# EAGLE design Fan speed controller v1 (EAGLE 5.12)
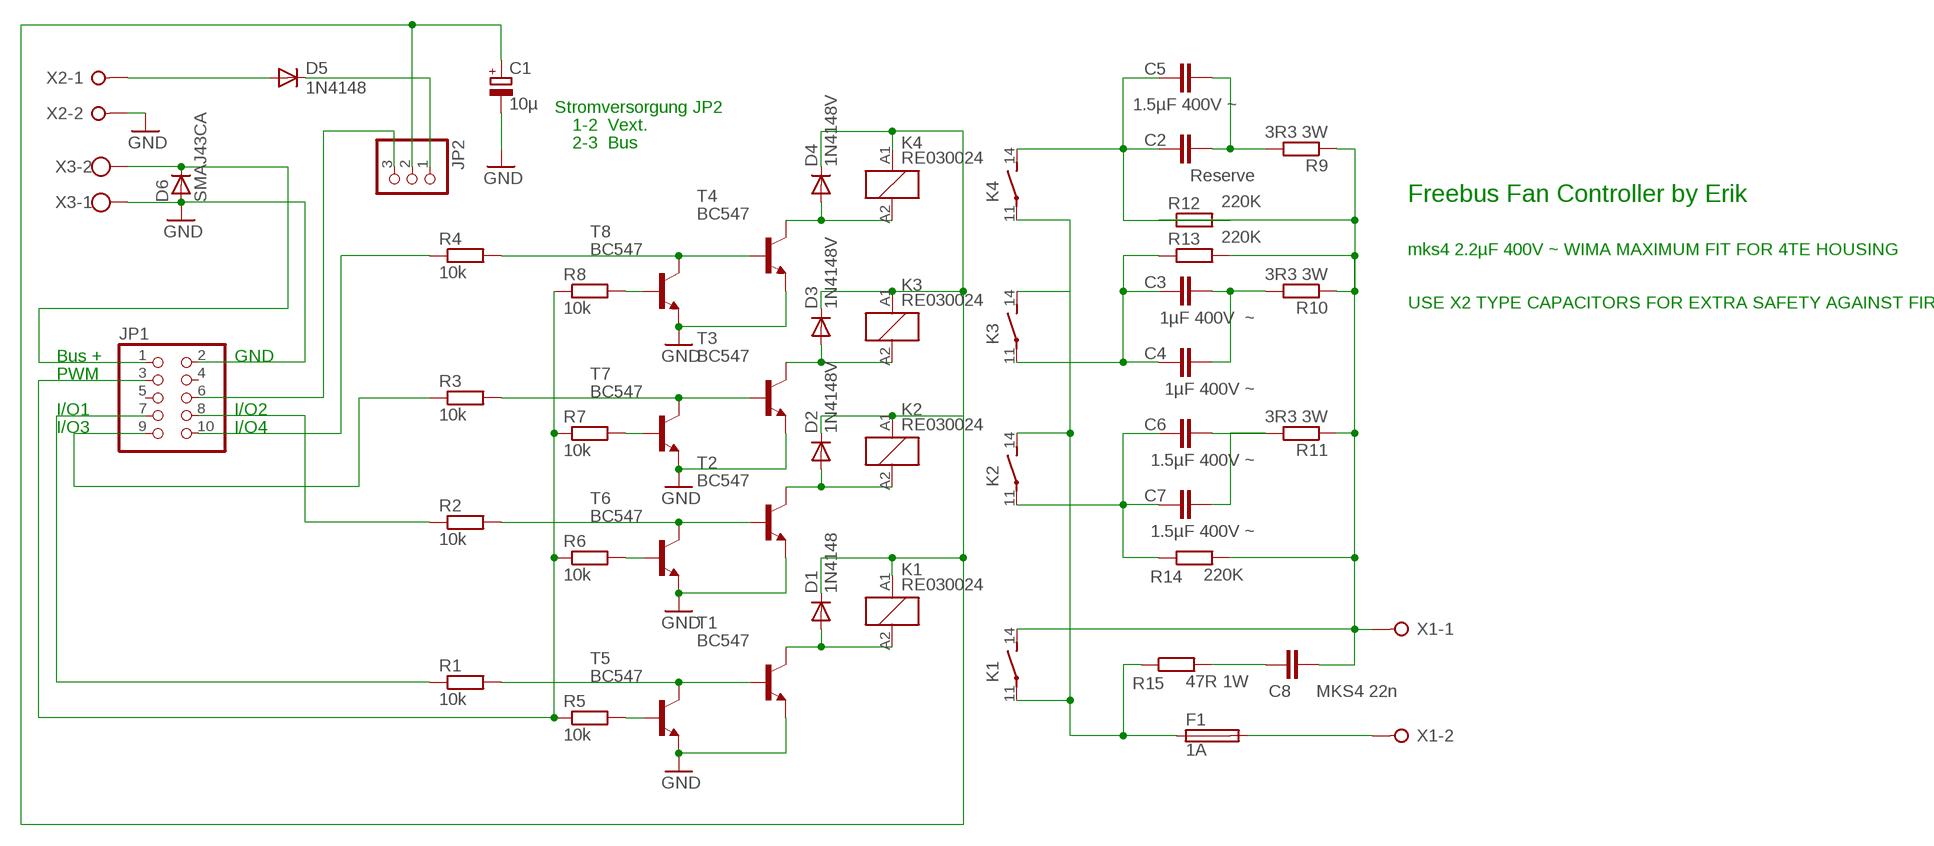
[diagram p0: schematic, sheet 1]

## Parts
C1  10µ  CPOL-EUE3.5-10  [E3,5-10]
C2  Reserve  C-EU275-113X316  [C275-113X316]
C3  1µF 400V ~  C-EU275-113X316  [C275-113X316]
C4  1µF 400V ~  C-EU275-113X316  [C275-113X316]
C5  1.5µF 400V ~  C-EU275-113X316  [C275-113X316]
C6  1.5µF 400V ~  C-EU275-113X316  [C275-113X316]
C7  1.5µF 400V ~  C-EU275-113X316  [C275-113X316]
C8  MKS4 22n  C7.5/6  [C7.5B6]
D1  1N4148  1N4148DO35-7  [DO35-7]
D2  1N4148V  1N4148DO35-7  [DO35-7]
D3  1N4148V  1N4148DO35-7  [DO35-7]
D4  1N4148V  1N4148DO35-7  [DO35-7]
D5  1N4148  1N4148DO35-7  [DO35-7]
D6  SMAJ43CA  D-SMB  [SMB]
F1  1A  SH22,5  [SH22,5]
JP1  PINHD-2X5  [2X05]
JP2  PINHD-1X3  [1X03]
K1  RE030024  [RE-SCHRACK]
K2  RE030024  [RE-SCHRACK]
K3  RE030024  [RE-SCHRACK]
K4  RE030024  [RE-SCHRACK]
R1  10k  R-EU_0207/7  [0207/7]
R2  10k  R-EU_0207/7  [0207/7]
R3  10k  R-EU_0207/7  [0207/7]
R4  10k  R-EU_0207/7  [0207/7]
R5  10k  R-EU_0207/7  [0207/7]
R6  10k  R-EU_0207/7  [0207/7]
R7  10k  R-EU_0207/7  [0207/7]
R8  10k  R-EU_0207/7  [0207/7]
R9  3R3 3W  R-EU_0613/15  [P0613/15]
R10  3R3 3W  R-EU_0613/15  [P0613/15]
R11  3R3 3W  R-EU_0613/15  [P0613/15]
R12  220K  R-EU_0207/5V  [0207/5V]
R13  220K  R-EU_0207/10  [0207/10]
R14  220K  R-EU_0207/10  [0207/10]
R15  47R 1W  R-EU_0207/5V  [0207/5V]
T1  BC547  [TO92]
T2  BC547  [TO92]
T3  BC547  [TO92]
T4  BC547  [TO92]
T5  BC547  [TO92]
T6  BC547  [TO92]
T7  BC547  [TO92]
T8  BC547  [TO92]
X1  W237-02P  [W237-132]
X2  W237-02P  [W237-132]
X3  W237-102  [W237-102]

## Nets
GND: C1.- D6.2(A) JP1.2 T1.1(E) T2.1(E) T3.1(E) T4.1(E) T5.1(E) T6.1(E) T7.1(E) T8.1(E) X2.2 X3.1
N$1: D5.A X2.1
N$2: C8.2 K1.14(2:S) R9.1 R10.1 R11.1 R12.1 R13.2 R14.2 X1.1
N$3: JP1.6 JP2.3
N$4: D6.1(C) JP1.1 X3.2
N$5: C2.1 C5.1 K4.14(2:S) R12.2
N$6: C3.1 C4.1 K3.11(2:P) R13.1
N$7: JP1.7 R1.1
N$8: C6.1 C7.1 K2.11(2:P) R14.1
N$9: JP1.8 R2.1
N$10: JP1.10 R4.1
N$11: R4.2 T4.2(B) T8.3(C)
N$12: JP1.3 R5.1 R6.1 R7.1 R8.1
N$13: F1.1 K1.11(2:P) K2.14(2:S) K3.14(2:S) K4.11(2:P) R15.1
N$14: R3.2 T3.2(B) T7.3(C)
N$15: C2.2 C5.2 R9.2
N$16: C3.2 C4.2 R10.2
N$17: R2.2 T2.2(B) T6.3(C)
N$18: R1.2 T1.2(B) T5.3(C)
N$19: D2.A K2.A2 T2.3(C)
N$20: R8.2 T8.2(B)
N$21: R7.2 T7.2(B)
N$22: R6.2 T6.2(B)
N$23: R5.2 T5.2(B)
N$24: D1.A K1.A2 T1.3(C)
N$25: C6.2 C7.2 R11.2
N$26: JP1.9 R3.1
N$27: C8.1 R15.2
N$28: F1.2 X1.2
N$31: D5.C JP2.1
R3: D3.A K3.A2 T3.3(C)
R4: D4.A K4.A2 T4.3(C)
VDD_IN: C1.+ D1.C D2.C D3.C D4.C JP2.2 K1.A1 K2.A1 K3.A1 K4.A1
Unconnected: JP1.4 JP1.5

## Notes on the sheet
- Stromversorgung JP2
- 1-2  Vext.
- 2-3  Bus
- Freebus Fan Controller by Erik
- mks4 2.2µF 400V ~ WIMA MAXIMUM FIT FOR 4TE HOUSING
- USE X2 TYPE CAPACITORS FOR EXTRA SAFETY AGAINST FIRE
- Bus + | GND
- PWM
- I/O1 | I/O2
- I/O3 | I/O4

## Library data of the parts
C1 = rcl:CPOL-EU: POLARIZED CAPACITOR, European symbol
C2-C7 = rcl:C-EU: CAPACITOR, European symbol
C8 = capacitor-wima:C: CAPACITOR naming: grid - package width
D1-D5 = diode:1N4148: DIODE high speed (Philips)
D6 = semicon-smd-ipc:D-: DIODE unfilled
F1 = fuse:SH22,5: FUSE HOLDER grid 22,5 mm, OGN0031 8201, Schurter (Buerklin); MF: SCHURTER; MPN: 0031.8201; OC_FARNELL: 1162740; OC_NEWARK: 96F8317
JP1 = pinhead:PINHD-2X5: PIN HEADER
JP2 = pinhead:PINHD-1X3: PIN HEADER
K1-K4 = relay:RE03*: Miniature PCB Relay 1 pole 6 A SCHRACK Source: http://www.schrack.com/.. 5812.pdf
R1-R15 = rcl:R-EU_: RESISTOR, European symbol
T1-T8 = transistor-npn:BC547*: NPN Transistor
X1 X2 = con-wago-508:W237-02P: WAGO SREW CLAMP; OC_FARNELL: unknown; OC_NEWARK: unknown
X3 = con-wago-500:W237-102: WAGO SCREW CLAMP; MPN: 237-102; OC_FARNELL: unknown; OC_NEWARK: 70K9898

## Board
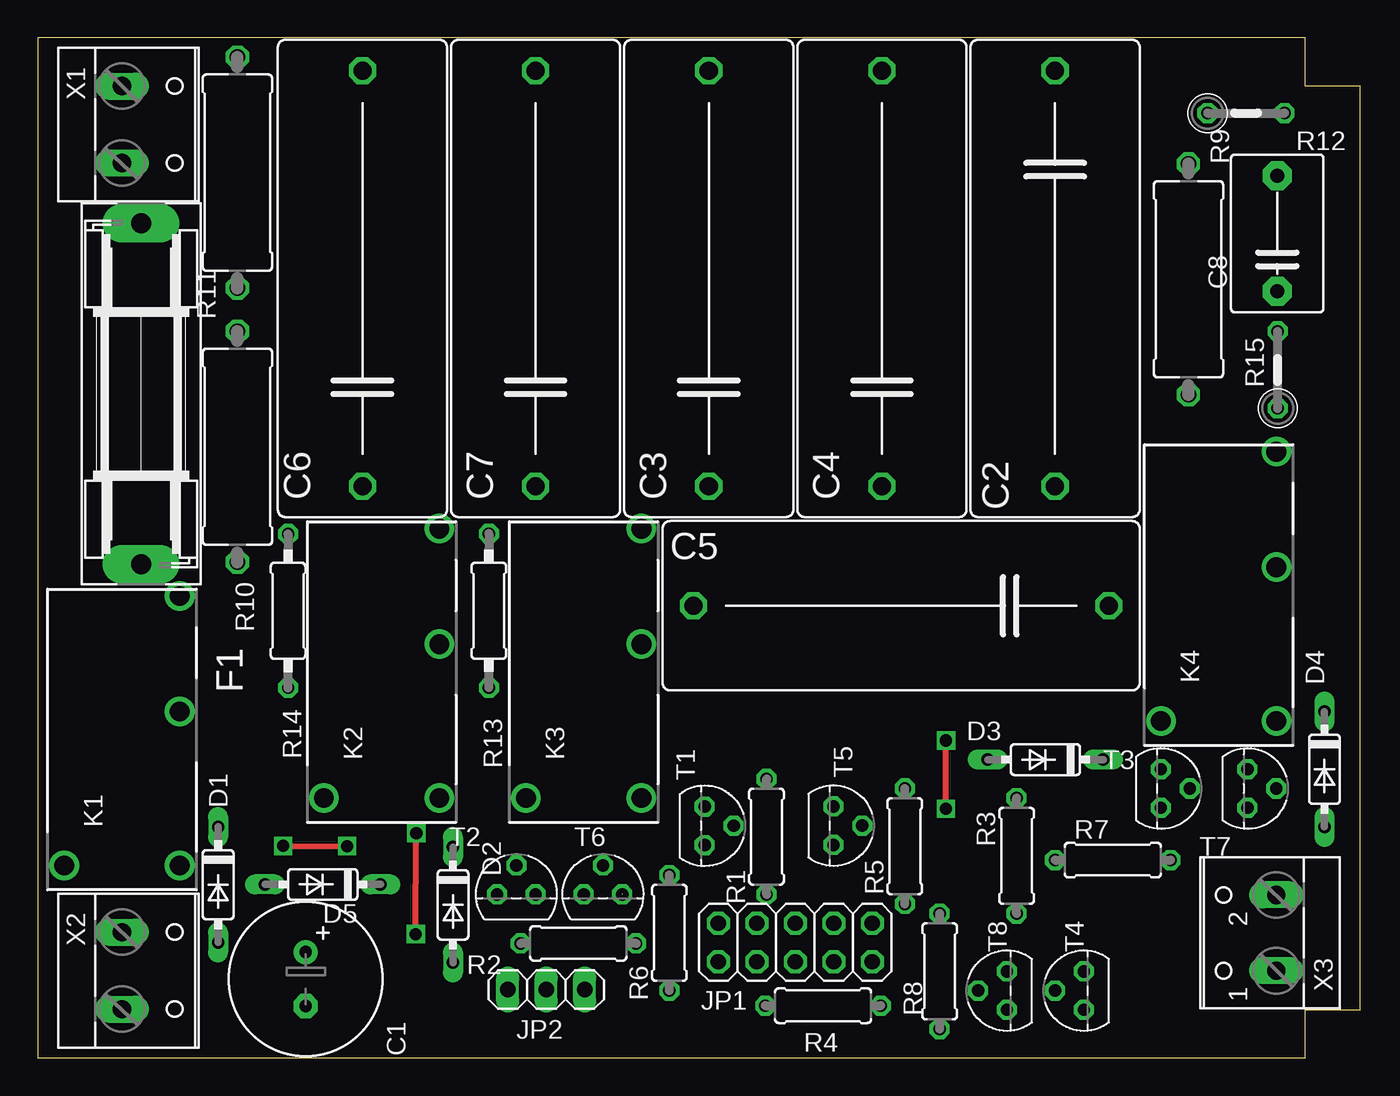
[diagram p1: board, top side]
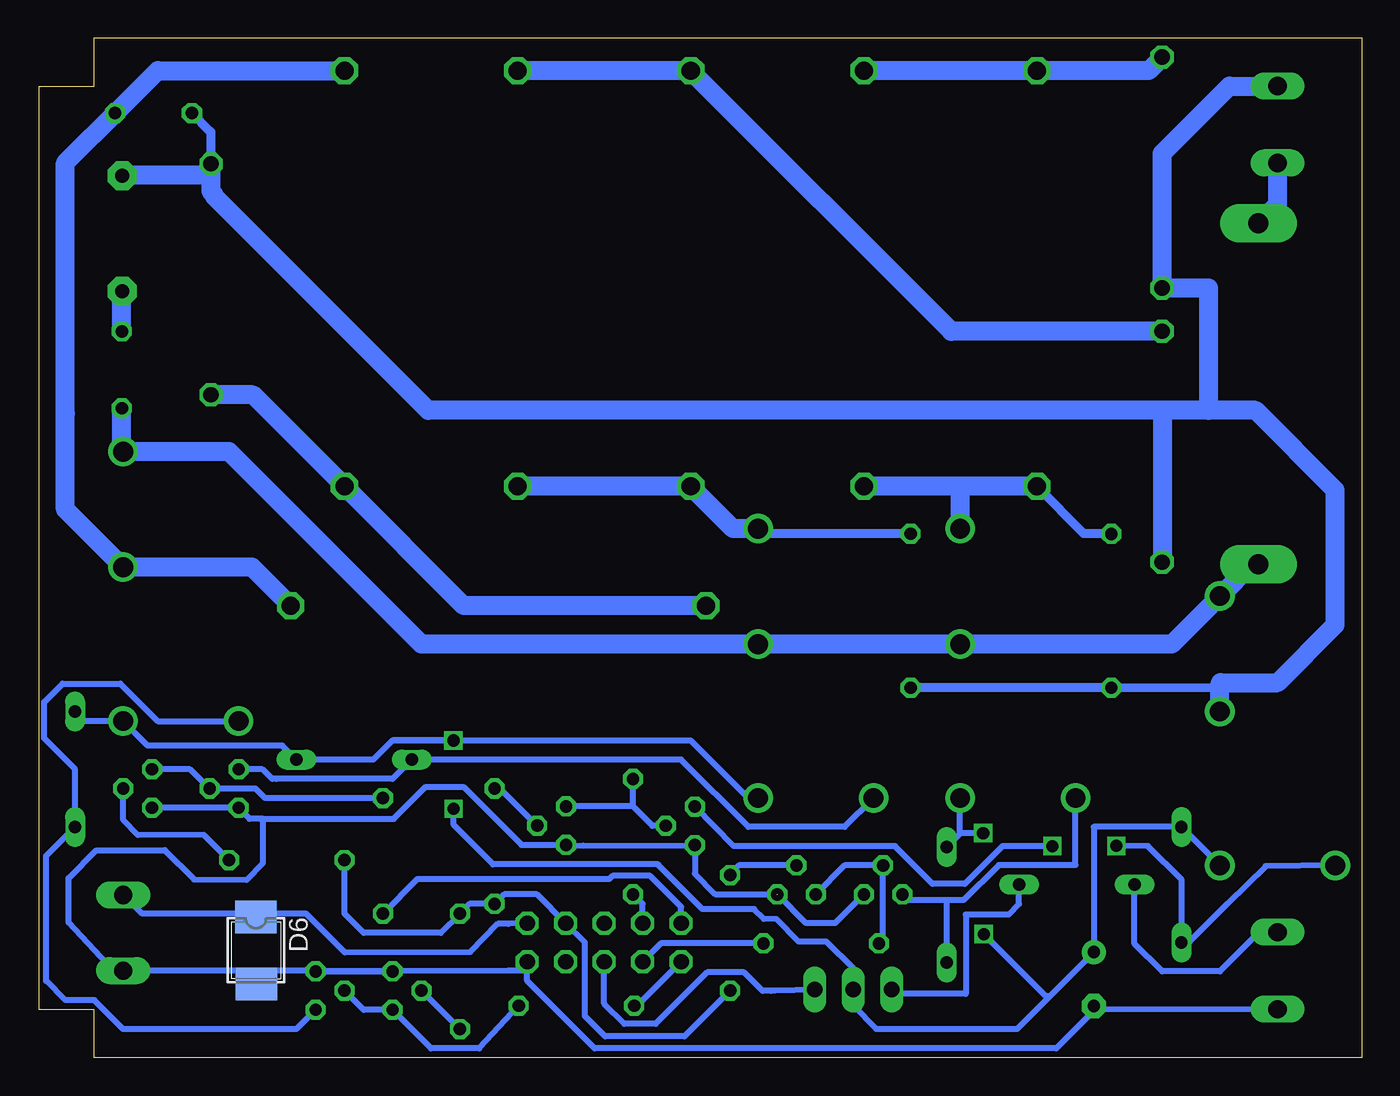
[diagram p2: board, bottom side, seen from below]

Size 87.3 x 67.31 mm. Coordinates in mm from the lower left corner, seen from the top.
Outline: 0,0.01 83.66,0 83.66,3.18 87.3,3.18 87.3,64.13 83.66,64.13 83.66,67.31 0,67.31 0,0.01
Copper layers (1*16): Top 0.035mm / dielectric 1.5mm / Bottom 0.035mm
Design rules "default *": minimum track width 10mil, minimum drill 24mil, track to track 8mil, track to pad 8mil, pad to pad 8mil, via to via 8mil, smd to smd 8mil, copper to edge 40mil, drill to drill 8mil, minimum pad ring 10mil, minimum via ring 8mil, stop-mask expansion 4mil, vias tented up to drill 0mil, thermal gap 10mil

### Footprints (pad centres in the part's own frame; a part is rotated, then mirrored left to right if it is on the bottom)
E3,5-10 = drill 0.813 pad 1.6 round: + -1.778,0 | drill 0.813 pad 1.6 octagon: - 1.778,0
C275-113X316 = drill 1.194 octagon: 1 -13.716,0; 2 13.716,0
C7.5B6 = drill 0.914 pad 1.905 octagon: 1 -3.81,0; 2 3.81,0
DO35-7 = drill 0.813 long: A 3.81,0; C -3.81,0
SMB = smd 2.159 x 2.743: 1 -2.311,-0.127; 2 2.108,-0.102
SH22,5 = drill 1.321 pad 2.54 long: 1 -11.252,0; 2 11.252,0
2X05 = drill 1.016 octagon: 1 -5.08,-1.27; 2 -5.08,1.27; 3 -2.54,-1.27; 4 -2.54,1.27; 5 0,-1.27; 6 0,1.27; 7 2.54,-1.27; 8 2.54,1.27; 9 5.08,-1.27; 10 5.08,1.27
1X03 = drill 1.016 long: 1 -2.54,0; 2 0,0; 3 2.54,0
RE-SCHRACK = drill 1.3 round: 11 8.89,-3.81; 14 1.27,-3.81; A1 -8.89,-3.81; A2 -8.89,3.81
0207/7 = drill 0.813 octagon: 1 -3.81,0; 2 3.81,0
P0613/15 = drill 1.016 octagon: 1 -7.62,0; 2 7.62,0
0207/5V = drill 0.813 octagon: 1 -2.54,0; 2 2.54,0
0207/10 = drill 0.813 octagon: 1 -5.08,0; 2 5.08,0
TO92 = drill 0.813 octagon: 1 1.27,0; 2 0,1.905; 3 -1.27,0
W237-132 = drill 1.194 long: 1 -2.54,-0.635; 2 2.54,-0.635
W237-102 = drill 1.194 long: 1 -2.5,-1.27; 2 2.5,-1.27

### Placement (x,y rotation side)
C1  17.68,5.2 270 top
C2  67.14,51.43 270 top
C3  44.28,51.43 90 top
C4  55.71,51.43 90 top
C5  56.98,29.85 180 top
C6  21.42,51.43 90 top
C7  32.85,51.43 90 top
C8  81.81,54.41 90 top
D1  11.9,11.43 270 top
D2  27.4,10.1 270 top
D3  66.51,19.69 180 top
D4  84.92,19.05 270 top
D5  18.81,11.45 180 top
D6  72.86,6.98 270 bottom
F1  6.82,43.81 90 top
JP1  50,7.62 180 top
JP2  33.55,4.51 0 top
K1  5.55,21.59 90 top
K2  22.7,26.04 90 top
K3  36.03,26.04 90 top
K4  77.94,31.12 90 top
R1  48.09,14.61 90 top
R2  35.67,7.56 180 top
R3  64.61,13.33 90 top
R4  51.83,3.45 0 top
R5  57.23,13.97 90 top
R6  41.68,8.26 90 top
R7  70.95,13.06 0 top
R8  59.52,5.71 270 top
R9  75.95,51.38 270 top
R10  13.17,40.33 90 top
R11  13.17,58.42 90 top
R12  79.75,62.34 0 top
R13  29.77,29.51 270 top
R14  16.52,29.5 270 top
R15  81.83,45.41 90 top
T1  44.02,15.32 270 top
T2  31.58,10.79 0 top
T3  74.13,17.78 270 top
T4  69.05,4.45 90 top
T5  52.51,15.33 270 top
T6  37.3,10.79 0 top
T7  79.84,17.78 270 top
T8  63.97,4.45 90 top
X1  6.18,61.59 270 top
X2  6.18,5.77 270 top
X3  80.48,8.26 90 top

### Tracks (layer width: path | path; a pad name or v marks a point on that pad's centre or on a via)
GND  (1 unrouted)
  Bottom 0.406: 72.86,5.75 X3.1 82.39,5.71 85.36,8.92 85.36,11.86 83.53,13.69 79.01,13.71 77.07,11.78 73.61,11.76 72.52,12.88 72.52,15.78 | X2.2 17.61,3.17 20.15,0.64 50.63,0.64 55.08,5.08 JP1.2 55.05,5.75 56.22,5.77 56.31,5.75 T4.1 T8.1 | T7.1 T3.1 74.13,16.5 73.41,15.78 72.68,15.78 72.52,15.78 | T2.1 34.76,8.89 36.66,8.89 T6.1 | 72.86,5.75 72.86,4.24 | 17.68,3.24 C1.- | 69.09,5.75 72.86,5.75 | 38.6,10.81 42.67,10.81 44.02,12.16 T1.1 51.37,14.01 T5.1 55.45,14.06 59.28,17.89 61.78,17.89 63.89,15.78 72.52,15.78
  Bottom 0.61: 72.86,4.24 D6.2 | 17.61,3.17 17.68,3.24
  Bottom 1.27: T4.1 69.09,5.75
N$1
  Bottom 0.406: X2.1 5.6,8.26 6.82,8.26 9.36,5.71 13.17,5.71 14.99,7.54 D5.A
N$2
  Bottom 0.61: R13.2 R14.2 9.48,24.4 9.32,24.77 | R12.1 76.02,61.16 arc45 75.95,60.98 R9.1
  Bottom 1.27: 10.1,42.72 7,42.72 1.74,37.46 1.74,28.58 5.55,24.77 9.32,24.77 9.36,24.72 K1.14 | 10.1,42.72 13.17,42.72 | 13.17,42.72 61.61,42.72 75.68,56.79 arc45 75.75,56.97 75.88,57.1 arc45 75.95,57.27 75.95,58.23 | X1.1 8.73,64.14 13.17,59.69 R11.1 10.1,50.8 10.1,42.72 | 13.17,42.72 R10.1 | 75.95,58.23 R9.1 | C8.2 arc45 81.77,58.23 75.95,58.23
N$3
  Bottom 0.406: JP2.3 38.72,4.44 38.98,4.42 39.54,4.42 40.77,5.65 43.2,5.65 46.6,2.24 48.66,2.24 50,3.58 JP1.6
N$4
  Bottom 0.406: 72.86,9.53 69.69,9.53 67.11,6.94 58.84,6.98 57.02,8.85 56.31,8.85 JP1.1 | 72.86,9.53 80.48,9.53 X3.2 | 72.86,9.53 73.09,9.3
  Bottom 0.61: 73.09,9.3 D6.1
N$5
  Bottom 0.406: 85.56,42.53 85.56,42.82 | R12.2 82.03,62.64 82.03,62.59
  Bottom 1.27: C2.1 79.46,65.15 82.03,62.59 85.56,59.05 85.56,42.53 85.56,36.2 K4.14 73.24,32.38 C5.1
N$6
  Bottom 0.61: R13.1 39.77,34.58 K3.11
  Bottom 1.27: K3.11 41.49,34.92 C3.1 C4.1
N$7
  Bottom 0.406: R1.1 47.46,10.16 JP1.7
N$8
  Bottom 0.61: R14.1 18.33,34.59 C6.1
  Bottom 1.27: C6.1 26.5,37.72 | 26.5,37.72 C7.1 | 26.5,37.72 K2.11
N$9
  Bottom 0.406: R2.1 46.25,7.56 JP1.8
N$10
  Bottom 0.406: R4.1 47.82,3.45 JP1.10
N$11
  Bottom 0.406: T4.2 65.88,3.17 T8.3 61.43,0.64 58.25,0.64 R4.2
N$12
  Bottom 0.406: R7.1 67.14,9.53 65.88,8.26 60.8,8.26 R8.1 58.89,10.16 R5.1 56.59,10.79 54.45,10.79 JP1.3 51.27,7.62 51.27,2.76 49.94,1.43 44.7,1.43 R6.1
N$13
  Bottom 1.27: F1.1 7.28,32.56 K1.11 12.54,27.31 K2.14 K3.14 62.06,27.31 74.77,40 K4.11 81.83,40 R15.1
N$14
  Bottom 0.406: T7.3 77.33,19.04 T3.2 73.01,17.78 72.37,17.15 R3.2
N$15
  Bottom 1.27: C5.2 59.27,29.85 C2.2 73.11,43.69 arc-45 73.29,43.76 R9.2
N$16
  Bottom 1.27: C4.2 C3.2 27.09,47.95 R10.2
N$17
  Bottom 0.406: T6.3 34.12,12.7 T2.2 31.61,7.75 R2.2
N$18
  Bottom 0.406: 48.09,16.6 T5.3 | 48.09,16.6 R1.2 | T1.2 46.82,15.32 48.09,16.6
N$19
  Bottom 0.406: K2.A2 18.88,12.72 23.96,12.72 26.27,10.41 27.33,10.41 | 27.33,10.41 29.93,10.41 T2.3 | D2.A 27.4,10.33 27.33,10.41
N$20
  Bottom 0.406: R8.2 T8.2
N$21
  Bottom 0.406: T7.2 81.74,15.7 80.78,14.7 76.42,14.72 R7.2
N$22
  Bottom 0.406: R6.2 41.11,12.7 T6.2
N$23
  Bottom 0.406: R5.2 56.87,17.78 T5.2
N$24  (via drill 0.8)
  Top 0.406: v16.2,13.99 v20.41,13.98
  Bottom 0.406: K1.A2 6.34,12.66 8.84,10.19 11.42,7.62 D1.A 11.87,7.65 11.87,11.75 14.1,13.98 v16.2,13.99 | T1.3 41.46,13.97 30.8,13.97 30.8,13.98 28.32,11.49 26.19,11.49 23.71,13.98 v20.41,13.98
N$25
  Bottom 1.27: C7.2 C6.2 14.06,65.15 R11.2
N$26
  Bottom 0.406: R3.1 62.34,11.79 49.68,11.79 49.45,12.02 46.97,12.02 44.92,9.97 JP1.9
N$27
  Bottom 1.27: C8.1 81.83,50.8 R15.2
N$28
  Bottom 1.27: X1.2 5.55,56.34 F1.2
N$31
  Bottom 0.406: JP2.1 30.74,4.24 26.12,4.24 26.12,9.46 23.3,9.46 22.62,10.15 D5.C
R3
  Bottom 0.406: T3.3 72.55,19.05 71.91,18.41 71.64,18.41 71.64,18.42 63.97,18.42 D3.A 44.92,19.69 40.48,15.24 34.12,15.24 K3.A2
R4
  Bottom 0.406: T4.3 70.32,1.91 81.75,1.91 83.66,3.81 85.56,3.81 86.83,5.08 86.83,13.33 D4.A 84.92,19.05 86.97,21.1 86.97,23.48 85.75,24.7 81.94,24.7 79.46,22.23 K4.A2
VDD_IN  (via drill 0.8)
  Top 0.406: v24.99,14.84 24.96,14.81 v24.94,8.17 | v59.95,20.95 59.95,16.46 v59.94,16.45
  Bottom 0.406: K1.A1 D1.C 17.68,15.24 C1.+ 20.59,4.07 | D4.C 84.29,22.23 K4.A1 80.14,20.62 71.25,20.62 D3.C 65.24,19.69 63.97,20.96 | K3.A1 40.48,17.15 44.28,20.96 63.97,20.96 | v59.95,20.95 63.97,20.96 | 20.59,4.07 22.75,1.91 32.03,1.91 33.55,3.43 JP2.2 33.55,5.91 35.33,7.68 37.16,7.68 38.64,9.15 39.46,9.19 40.1,9.83 43.52,9.83 46.41,12.72 arc-90 46.47,12.78 57.34,12.78 59.94,15.38 v59.94,16.45 | K2.A1 26.5,14.81 D2.C 26.47,14.84 v24.99,14.84 | v24.94,8.17 20.84,4.07 20.59,4.07

### Text on the board
bDocu: Freebus Fan Controller by Erik